# Altium project TSAL_Control.PrjPcb (part 2 of 4)

## Sheet [2] Implausibilities.SchDoc
size A4
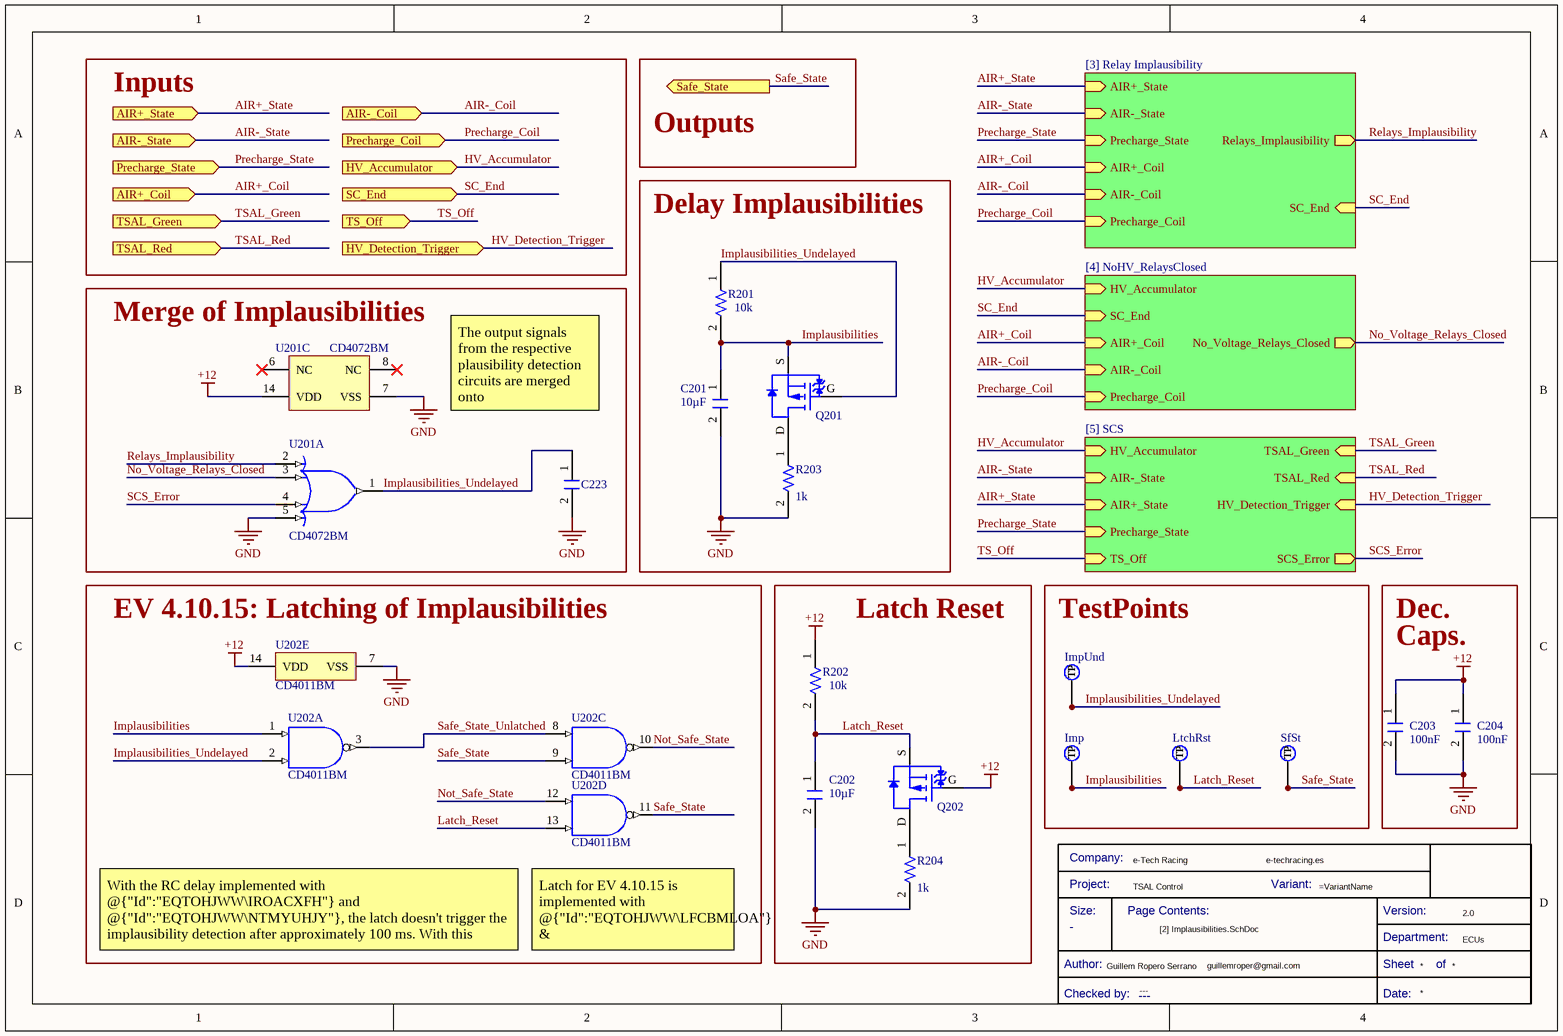
[diagram p2: [2] Implausibilities.SchDoc]

### Parts
(Parts that share a designator on the sheet are numbered #1, #2 ... from top to bottom, then left to right.)
*#3  Checked by:: ---  (hidden comment: Title Block_template)  (graphical)
C201  value 10µF  [C0805FNPC-R]  (hidden comment: C10u-16V-0805FNPC-X5R)
C202  value 10µF  [C0805FNPC-R]  (hidden comment: C10u-16V-0805FNPC-X5R)
C203  value 100nF  [C0805FNPC-R]  (hidden comment: C100n-50V-0805FNPC-X7R)
C204  value 100nF  [C0805FNPC-R]  (hidden comment: C100n-50V-0805FNPC-X7R)
C223  C15p-50V-0805FNPC-NP0  [C0805FNPC-R]  (value not drawn)
Imp  TestPoint  [TestPoint]  (value not drawn)  (no BOM)
ImpUnd  TestPoint  [TestPoint]  (value not drawn)  (no BOM)
LtchRst  TestPoint  [TestPoint]  (value not drawn)  (no BOM)
Q201  TRT-PCH-2/30-BSS  [TRT-PCH-2/30-BSS]  (value not drawn)
Q202  TRT-PCH-2/30-BSS  [TRT-PCH-2/30-BSS]  (value not drawn)
R201  value 10k  [R0805FTK]  (hidden comment: R10k-0805FTK)
R202  value 10k  [R0805FTK]  (hidden comment: R10k-0805FTK)
R203  value 1k  [0805]  (hidden comment: R1K-0805-0.5W)
R204  value 1k  [0805]  (hidden comment: R1K-0805-0.5W)
SfSt  TestPoint  [TestPoint]  (value not drawn)  (no BOM)
U201  CD4072BM  [D0014A_N]  (parts A,C of 3)
U202  CD4011BM  [D0014A_N]  (parts A,C,D,E of 5)

### Blocks framed on the sheet
Delay Implausibilities: C201 Q201 R201 R203
Merge of Implausibilities: C223 U201
EV 4.10.15: Latching of Implausibilities: U202
Latch Reset: C202 Q202 R202 R204
TestPoints: Imp ImpUnd LtchRst SfSt

### Sub-sheets
EV 4.10.14 = [4] NoHV_RelaysClosed: HV_Accumulator (in), SC_End (in), AIR+_Coil (in), AIR-_Coil (in), Precharge_Coil (in), No_Voltage_Relays_Closed (out)
Relay Implausibility = [3] Relay Implausibility: AIR+_State (in), Precharge_State (in), AIR+_Coil (in), AIR-_Coil (in), Precharge_Coil (in), Relays_Implausibility (out), SC_End (in), AIR-_State (in)
SCS = [5] SCS: HV_Accumulator (in), AIR-_State (in), Precharge_State (in), SCS_Error (out), AIR+_State (in), TSAL_Green (in), TSAL_Red (in), TS_Off (in), HV_Detection_Trigger (in)

### Ports
AIR+_Coil (in, see [1] TSAL_Green[1C], [1] TSAL_Green[2A], [3] Relay Implausibility[1A], [4] NoHV_RelaysClosed[1A]), AIR+_State (in, see [1] TSAL_Green[1C], [1] TSAL_Green[2A], [3] Relay Implausibility[1A], [5] SCS[1A]), AIR-_Coil (in, see [1] TSAL_Green[1C], [1] TSAL_Green[2A], [3] Relay Implausibility[1A], [4] NoHV_RelaysClosed[1A]), AIR-_State (in, see [1] TSAL_Green[1C], [1] TSAL_Green[2A], [3] Relay Implausibility[1A], [5] SCS[1A]), HV_Accumulator (in, see [1] TSAL_Green[1C], [1] TSAL_Green[2B], [4] NoHV_RelaysClosed[1A], [5] SCS[1A]), HV_Detection_Trigger (in, see [1] TSAL_Green[1C], [1] TSAL_Green[2B], [5] SCS[1A], [7] TSAL_Red[2A]), Precharge_Coil (in, see [1] TSAL_Green[1C], [1] TSAL_Green[2B], [3] Relay Implausibility[1A], [4] NoHV_RelaysClosed[1A]), Precharge_State (in, see [1] TSAL_Green[1C], [1] TSAL_Green[2A], [3] Relay Implausibility[1A], [5] SCS[1A]), Safe_State (out, see [1] TSAL_Green[2C]), SC_End (in, see [1] TSAL_Green[1C], [1] TSAL_Green[2B], [3] Relay Implausibility[1B], [4] NoHV_RelaysClosed[1A]), TS_Off (in, see [1] TSAL_Green[1D], [1] TSAL_Green[4A], [5] SCS[1A], [6] Green_Driver[1A]), TSAL_Green (in, see [1] TSAL_Green[1D], [1] TSAL_Green[4A], [5] SCS[1A], [6] Green_Driver[2A]), TSAL_Red (in, see [1] TSAL_Green[1D], [1] TSAL_Green[3A], [5] SCS[1B], [7] TSAL_Red[2A], [8] Red_Driver[2A])

### Nets
+12: C203.1 C204.1 Q202.G R202.1 U201.14(VDD) U202.14(VDD)
GND: C201.2 C202.2 C203.2 C204.2 C223.2 R203.2 R204.2 U201.5(D) U201.7(VSS) U202.7(VSS)
AIR+_Coil: port AIR+_Coil, sheet Relay Implausibility/AIR+_Coil, sheet EV 4.10.14/AIR+_Coil
AIR+_State: port AIR+_State, sheet Relay Implausibility/AIR+_State, sheet SCS/AIR+_State
AIR-_Coil: port AIR-_Coil, sheet Relay Implausibility/AIR-_Coil, sheet EV 4.10.14/AIR-_Coil
AIR-_State: port AIR-_State, sheet Relay Implausibility/AIR-_State, sheet SCS/AIR-_State
HV_Accumulator: port HV_Accumulator, sheet SCS/HV_Accumulator, sheet EV 4.10.14/HV_Accumulator
HV_Detection_Trigger: port HV_Detection_Trigger, sheet SCS/HV_Detection_Trigger
Implausibilities: C201.1 Imp.1(TP) Q201.S R201.2 U202.1(A)
Implausibilities_Undelayed: C223.1 ImpUnd.1(TP) Q201.G R201.1 U201.1(J) U202.2(B)
Latch_Reset: C202.1 LtchRst.1(TP) Q202.S R202.2 U202.13(H)
No_Voltage_Relays_Closed: U201.3(B) ; sheet EV 4.10.14/No_Voltage_Relays_Closed
Not_Safe_State: U202.10(L) U202.12(G)
Precharge_Coil: port Precharge_Coil, sheet Relay Implausibility/Precharge_Coil, sheet EV 4.10.14/Precharge_Coil
Precharge_State: port Precharge_State, sheet Relay Implausibility/Precharge_State, sheet SCS/Precharge_State
Relays_Implausibility: U201.2(A) ; sheet Relay Implausibility/Relays_Implausibility
Safe_State: SfSt.1(TP) U202.9(F) U202.11(M) ; port Safe_State
Safe_State_Unlatched: U202.3(J) U202.8(E)
SC_End: port SC_End, sheet Relay Implausibility/SC_End, sheet EV 4.10.14/SC_End
SCS_Error: U201.4(C) ; sheet SCS/SCS_Error
TS_Off: port TS_Off, sheet SCS/TS_Off
TSAL_Green: port TSAL_Green, sheet SCS/TSAL_Green
TSAL_Red: port TSAL_Red, sheet SCS/TSAL_Red
NetQ201_D: Q201.D R203.1
NetQ202_D: Q202.D R204.1

Not connected (* = marked no-connect by the designer): U201 6(NC)* 8(NC)*

### Notes on the sheet
- Inputs
- Outputs
- The output signals from the respective plausibility detection circuits are merged onto @{"Id":"EQTOHJWW\DMHHQXNO"}.
- Dec.
- Caps.
- With the RC delay implemented with @{"Id":"EQTOHJWW\IROACXFH"} and @{"Id":"EQTOHJWW\NTMYUHJY"}, the latch doesn't trigger the implausibility detection after approximately 100 ms. With this system, possible faulty implausibility detections are avoided (e.g. AIRs activation delay).
- (near U202) Latch for EV 4.10.15 is implemented with @{"Id":"EQTOHJWW\LFCBMLOA"} & @{"Id":"EQTOHJWW\TXFEAGDM"}
- (in symbol CMP-00043-8) Company:; Project:; Variant:; Size:; Page Contents:; Version:; Department:; Author:; Sheet; of; Checked by:; Date:

### Library data of the parts
*#3 = CMP-00043-8: Standard Title Block; .SCHcheck: GP; Size: -; Design Item ID: Title Block_template; .PCBcheck: GP; .Creator: GP; Source: e-Tech_Racing.SchLib; Category: Title Block
C201 C202 = CMP-00055-8: Multilayer Ceramic Capacitor, Wcap-Csgp Series, 10 F, 20%, X5R, 16 V, 0805 [2012 Metric] Rohs Compliant: Yes; Manufacturer Part Number 1: 885012107014; Manufacturer 1: Wurth Electronics; .Creator: DR; Voltage Rating: 16V; Pricing 1: 50=0,21000, 250=0,20200, 500=0,19100, 1000=0,17400, 2500=0,14700 (GBP); ComponentLink3URL: https://katalog.we-online.de/pbs/datasheet/885012107014.pdf?src-supplier=Digi-Key; Category: Ceramic Capacitors; Thickness: 0.057inch; ComponentLink4URL: http://www.farnell.com/datasheets/1958454.pdf?src-supplier=Newark; Width: 0.049inch; Source: Passives.SchLib; Design Item ID: C10u-16V-0805FNPC-X5R; Packaging: Cut Tape; ComponentLink3Description: https://katalog.we-online.de/pbs/datasheet/885012107014.pdf?src-supplier=Digi-Key; ComponentLink2URL: http://www.farnell.com/datasheets/1958454.pdf?src-supplier=Element14; RoHS: Yes; ComponentLink1Description: http://www.farnell.com/datasheets/1958454.pdf?src-supplier=Farnell; ComponentLink2Description: http://www.farnell.com/datasheets/1958454.pdf?src-supplier=Element14; Min Operating Temperature: -55°C; Case Code (Metric): 2012; Case/Package: 0805; Mount: Surface Mount; Tolerance: 20%; Length: 0.079inch; ComponentLink4Description: http://www.farnell.com/datasheets/1958454.pdf?src-supplier=Newark; ComponentLink1URL: http://www.farnell.com/datasheets/1958454.pdf?src-supplier=Farnell; Dielectric: X5R; RoHS Compliant: Yes; Voltage Rating (DC): 16V; Max Operating Temperature: 85°C; Stock 1: 81550; REACH SVHC: Unknown
C203 C204 = CMP-00063-3: Cap, 0.1ΜF, 50V, 10%, X7R, 0805; Manufacturer Part Number 1: 885012207098; Manufacturer 1: Wurth Electronics; .Creator: DR; ComponentLink2Description: http://www.farnell.com/datasheets/1958498.pdf?src-supplier=Element14; ComponentLink1Description: http://www.farnell.com/datasheets/1958498.pdf?src-supplier=Farnell; Thickness: 0.035inch; ComponentLink1URL: http://www.farnell.com/datasheets/1958498.pdf?src-supplier=Farnell; Min Operating Temperature: -55°C; Packaging: Cut Tape; ComponentLink2URL: http://www.farnell.com/datasheets/1958498.pdf?src-supplier=Element14; Mount: Surface Mount; Voltage Rating (DC): 50V; Tolerance: 10%; Category: Ceramic Capacitors; RoHS: Yes; Width: 0.049inch; Pricing 1: 100=0,10200, 500=0,07100, 2000=0,06100 (GBP); RoHS Compliant: Yes; ComponentLink4Description: http://www.farnell.com/datasheets/1958498.pdf?src-supplier=Newark; Dielectric: X7R; Stock 1: 8000; Length: 0.079inch; ComponentLink3URL: https://katalog.we-online.de/pbs/datasheet/885012207098.pdf?src-supplier=Digi-Key; ComponentLink3Description: https://katalog.we-online.de/pbs/datasheet/885012207098.pdf?src-supplier=Digi-Key; Design Item ID: C100n-50V-0805FNPC-X7R; ComponentLink4URL: http://www.farnell.com/datasheets/1958498.pdf?src-supplier=Newark; REACH SVHC: Unknown; Case Code (Metric): 2012; Voltage Rating: 50V; Max Operating Temperature: 125°C; Source: Passives.SchLib; Case/Package: 0805
C223 = CMP-00056-3: Cap, 15PF, 50V, 5%, C0G/NP0, 0805; Manufacturer Part Number 1: 885012007052; Manufacturer 1: Wurth Electronics; .Creator: DR; Thickness: 0.028inch; RoHS Compliant: Yes; ComponentLink2URL: http://katalog.we-online.de/pbs/datasheet/885012007052.pdf?src-supplier=Digi-Key; Design Item ID: C15p-50V-0805FNPC-NP0; Case Code (Metric): 2012; Max Operating Temperature: 125°C; Mount: Surface Mount; Category: Ceramic Capacitors; Min Operating Temperature: -55°C; Case/Package: 0805; ComponentLink3Description: https://katalog.we-online.de/pbs/datasheet/885012007052.pdf?src-supplier=Digi-Key; ComponentLink1Description: http://www.farnell.com/datasheets/2031702.pdf?src-supplier=Farnell; ComponentLink1URL: http://www.farnell.com/datasheets/2031702.pdf?src-supplier=Farnell; RoHS: Yes; Voltage Rating: 50V; Length: 0.079inch; Source: Passives.SchLib; Value: 15pF; Pricing 1: 1=0,10800, 10=0,05200, 25=0,05100, 50=0,04900, 100=0,04800, 250=0,04600, 500=0,04300 (USD); Tolerance: 5%; ComponentLink3URL: https://katalog.we-online.de/pbs/datasheet/885012007052.pdf?src-supplier=Digi-Key; Stock 1: 815; Packaging: Cut Tape; Width: 0.049inch; ComponentLink2Description: http://katalog.we-online.de/pbs/datasheet/885012007052.pdf?src-supplier=Digi-Key
Imp ImpUnd LtchRst SfSt = CMP-00042-2: Test Point 1x1 mm; .SCHcheck: GP; Category: TestPoint; Source: e-Tech_Racing.SchLib; .Creator: GP; .PCBcheck: GP; Design Item ID: TestPoint
Q201 Q202 = CMP-00144-2: Infineon’s highly innovative OptiMOS™ families include p-channel power MOSFETs, SOT-23-3, RoHS; Manufacturer Part Number: BSS308PEH6327; .Creator: DO; Drain to Source Voltage (Vdss): 30V; Rise Time: 7.7ns; Turn-On Delay Time: 5.6ns; Fall Time: 2.8ns; Input Capacitance: 500pF; Turn-Off Delay Time: 15.3ns; Rds On Max: 80mR; Threshold Voltage: -1.5V; Gate to Source Voltage (Vgs): 20V; Max Power Dissipation: 500mW; Continuous Drain Current (ID): 2A; Stock 1: 4000; ComponentLink1Description: datasheet; Series: OptiMOS™; Source: Semiconductor.SchLib; Number of Pins: 3; ComponentLink2Description: https://datasheet.ciiva.com/11171/infineon-bss308pe-ds-v02-03-en-11171385.pdf?src-supplier=Avnet; REACH SVHC: No SVHC; Mount: Surface Mount; Min Operating Temperature: -55°C; Package Quantity: 1; Design Item ID: TRT-PCH-2/30-BSS; Max Operating Temperature: 150°C; Packaging: Tape and Reel; RoHS: Yes; Category: MOSFETs; Pricing 1: 50=0,50300, 100=0,26400, 250=0,25900, 500=0,25200, 1000=0,24700 (USD); Case/Package: TO-236-3; ComponentLink1URL: https://datasheet.ciiva.com/6379/infineon-bss308pe-ds-v02-03-en-6379920.pdf?src-supplier=Digi-Key; ComponentLink2URL: https://datasheet.ciiva.com/11171/infineon-bss308pe-ds-v02-03-en-11171385.pdf?src-supplier=Avnet; Manufacturer: Infineon
R201 R202 = CMP-00085-4: BOURNS         CR0805-JW-103ELF            Surface Mount Chip Resistor, Thick Film, CR Series, 10 kohm, 125 mW,  5%, 150 V; .Creator: DR; Power Rating: 125mW; Voltage Rating (DC): 100V; Voltage Rating: 150V; Temperature Coefficient: 200ppm/°C; ComponentLink6URL: https://datasheet.ciiva.com/16783/70154685-16783482.pdf?src-supplier=Allied+Electronics; Manufacturer 1: Bourns; Package Quantity: 1; ComponentLink10URL: https://datasheet.ciiva.com/7985/1856384-7985869.pdf?src-supplier=Element14; Technology: THICK FILM; Source: Passives.SchLib; RoHS Compliant: Yes; ComponentLink10Description: https://datasheet.ciiva.com/7985/1856384-7985869.pdf?src-supplier=Element14; ComponentLink1URL: https://datasheet.ciiva.com/11821/0900766b80fcdb72-11821135.pdf?src-supplier=RSComponents; ComponentLink7Description: https://datasheet.ciiva.com/5548/chpreztr-5548491.pdf?src-supplier=Mouser; Radiation Hardening: No; Design Item ID: R10k-0805FTK; ComponentLink4Description: https://datasheet.ciiva.com/7986/691949-7986187.pdf?src-supplier=Element14; Pins: 2; ComponentLink9URL: https://datasheet.ciiva.com/6559/chpreztr-6559901.pdf?src-supplier=Digi-Key; Resistor Type: Thick Film; ComponentLink4URL: https://datasheet.ciiva.com/7986/691949-7986187.pdf?src-supplier=Element14; Contact Plating: Tin; Case Code (Metric): 2012; Military Standard: Not; Depth: 1.25mm; Case/Package: 0805; Packaging: Tape and Reel; ComponentLink9Description: https://datasheet.ciiva.com/6559/chpreztr-6559901.pdf?src-supplier=Digi-Key; Construction: Rectangular; Pricing 1: 1=0,05790, 10=0,01540, 25=0,01340, 100=0,00340 (USD); ComponentLink7URL: https://datasheet.ciiva.com/5548/chpreztr-5548491.pdf?src-supplier=Mouser; Category: Chip SMD Resistors; Length: 2mm; Max Operating Temperature: 155°C; Resistance Tolerance: 5%; Manufacturer Part Number 1: CR0805-JW-103ELF; Height: 0.5mm; ComponentLink2URL: https://datasheet.ciiva.com/9122/chpreztr-9122374.pdf?src-supplier=Avnet; Thickness: 508um; Max Power Dissipation: 125mW; ComponentLink8Description: https://datasheet.ciiva.com/6559/chpreztr-6559900.pdf?src-supplier=Digi-Key; REACH SVHC: No SVHC; ComponentLink8URL: https://datasheet.ciiva.com/6559/chpreztr-6559900.pdf?src-supplier=Digi-Key; ComponentLink5URL: https://datasheet.ciiva.com/30065/159chpreztr-30065976.pdf?src-supplier=Onlinecomponents.com; Width: 1.25mm; ComponentLink11URL: https://datasheet.ciiva.com/48692/001055517-da-01-en-smd-wid-cr0805-jw-103elf-10k-ohm-1-8w-48692118.pdf?src-supplier=Conrad; ComponentLink3Description: https://datasheet.ciiva.com/22693/1902866-22693254.pdf?src-supplier=Element14; ComponentLink11Description: https://datasheet.ciiva.com/48692/001055517-da-01-en-smd-wid-cr0805-jw-103elf-10k-ohm-1-8w-48692118.pdf?src-supplier=Conrad; ComponentLink1Description: https://datasheet.ciiva.com/11821/0900766b80fcdb72-11821135.pdf?src-supplier=RSComponents; ComponentLink2Description: https://datasheet.ciiva.com/9122/chpreztr-9122374.pdf?src-supplier=Avnet; Stock 1: 57566; Min Operating Temperature: -55°C; Series: CR0805; Number of Terminations: 2; Termination: SMD/SMT; Tolerance: 5%; Mount: Surface Mount; ComponentLink6Description: https://datasheet.ciiva.com/16783/70154685-16783482.pdf?src-supplier=Allied+Electronics; ComponentLink5Description: https://datasheet.ciiva.com/30065/159chpreztr-30065976.pdf?src-supplier=Onlinecomponents.com; RoHS: Yes; Features: Moisture Resistant; ComponentLink3URL: https://datasheet.ciiva.com/22693/1902866-22693254.pdf?src-supplier=Element14
R203 R204 = CMP-009-00043-2: Fixed Resistor, Metal Glaze/thick Film, 0.5W, 1000ohm, 150V, 1% +/-Tol, 100ppm/Cel, Surface Mount, 0805; Power: 500mW; Pins: 2; RoHS Compliant: Yes; Tolerance: 1%; Case/Package: 0805; Min Operating Temperature: -55°C; Mounting Technology: Surface Mount; Max Operating Temperature: 155°C
U201 = CMP-00217-1: OR Gate, 4000/14000/40000 Series, 2-Func, 4-Input, CMOS, PDSO14; Package Equivalence Code: SOP14,.25; Package Body Material: Plastic; Power Supplies: 5/15V; Schmitt Trigger: No; Propagation Delay (tpd): 250ns; Nominal Supply Voltage: 5V; Min Supply Voltage: 3V; Channels: 2; Output Characteristics: OPEN-COLLECTOR; Max Supply Voltage: 18V; Load Capacitance (CL): 50pF; Logic Type: OR GATE; Qualification Status: Not Qualified; Number of Inputs: 4; Length: 8.65mm; Technology: CMOS; Surface Mount: Yes; Packaging: Rail/Tube; JESD-609 Code: e4; Terminal Pitch: 1.27mm; Package Shape: Rectangular; Package Style: SMALL OUTLINEMeter; Max Operating Temperature: 125°C; Terminal Position: DUAL; Reach SVHC Compliant: Yes; Terminal Form: Gull Wing; JESD-30 Code: R-PDSO-G14; Width: 3.9mm; Moisture Sensitivity Level: 1; Peak Reflow Temperature (Cel): 260°C; Temperature Grade: MILITARY; Pins: 14; Case/Package: SOP; Terminal Finish: Nickel; Min Operating Temperature: -55°C; Height - Seated (Max): 1.75mm; Prop. Delay@Nom-Sup: 250ns; RoHS Compliant: Yes
U202 = CMP-00211-1: NAND Gate, 4000/14000/40000 Series, 4-Func, 2-Input, CMOS, PDSO14; Package Equivalence Code: SOP14,.25; Package Body Material: Plastic; Load Capacitance (CL): 50pF; Max Supply Voltage: 18V; Min Supply Voltage: 3V; Nominal Supply Voltage: 5V; Propagation Delay (tpd): 250ns; Number of Inputs: 2; Channels: 4; Qualification Status: Not Qualified; Load/Preset Input: Yes; Schmitt Trigger: No; Power Supplies: 5/15V; Height - Seated (Max): 1.75mm; Technology: CMOS; Surface Mount: Yes; Case/Package: SOP; Pins: 14; Terminal Finish: Nickel; RoHS Compliant: Yes; Terminal Pitch: 1.27mm; Length: 8.65mm; Reach SVHC Compliant: Yes; Temperature Grade: MILITARY; Moisture Sensitivity Level: 1; Peak Reflow Temperature (Cel): 260°C; JESD-30 Code: R-PDSO-G14; Package Style: SMALL OUTLINEMeter; Logic Type: NAND GATE; Package Shape: Rectangular; Terminal Form: Gull Wing; Prop. Delay@Nom-Sup: 250ns; JESD-609 Code: e4; Min Operating Temperature: -55°C; Max Operating Temperature: 125°C; Width: 3.9mm; Terminal Position: DUAL; Packaging: Tape and Reel

## Sheet [3] Relay Implausibility.SchDoc
size A4
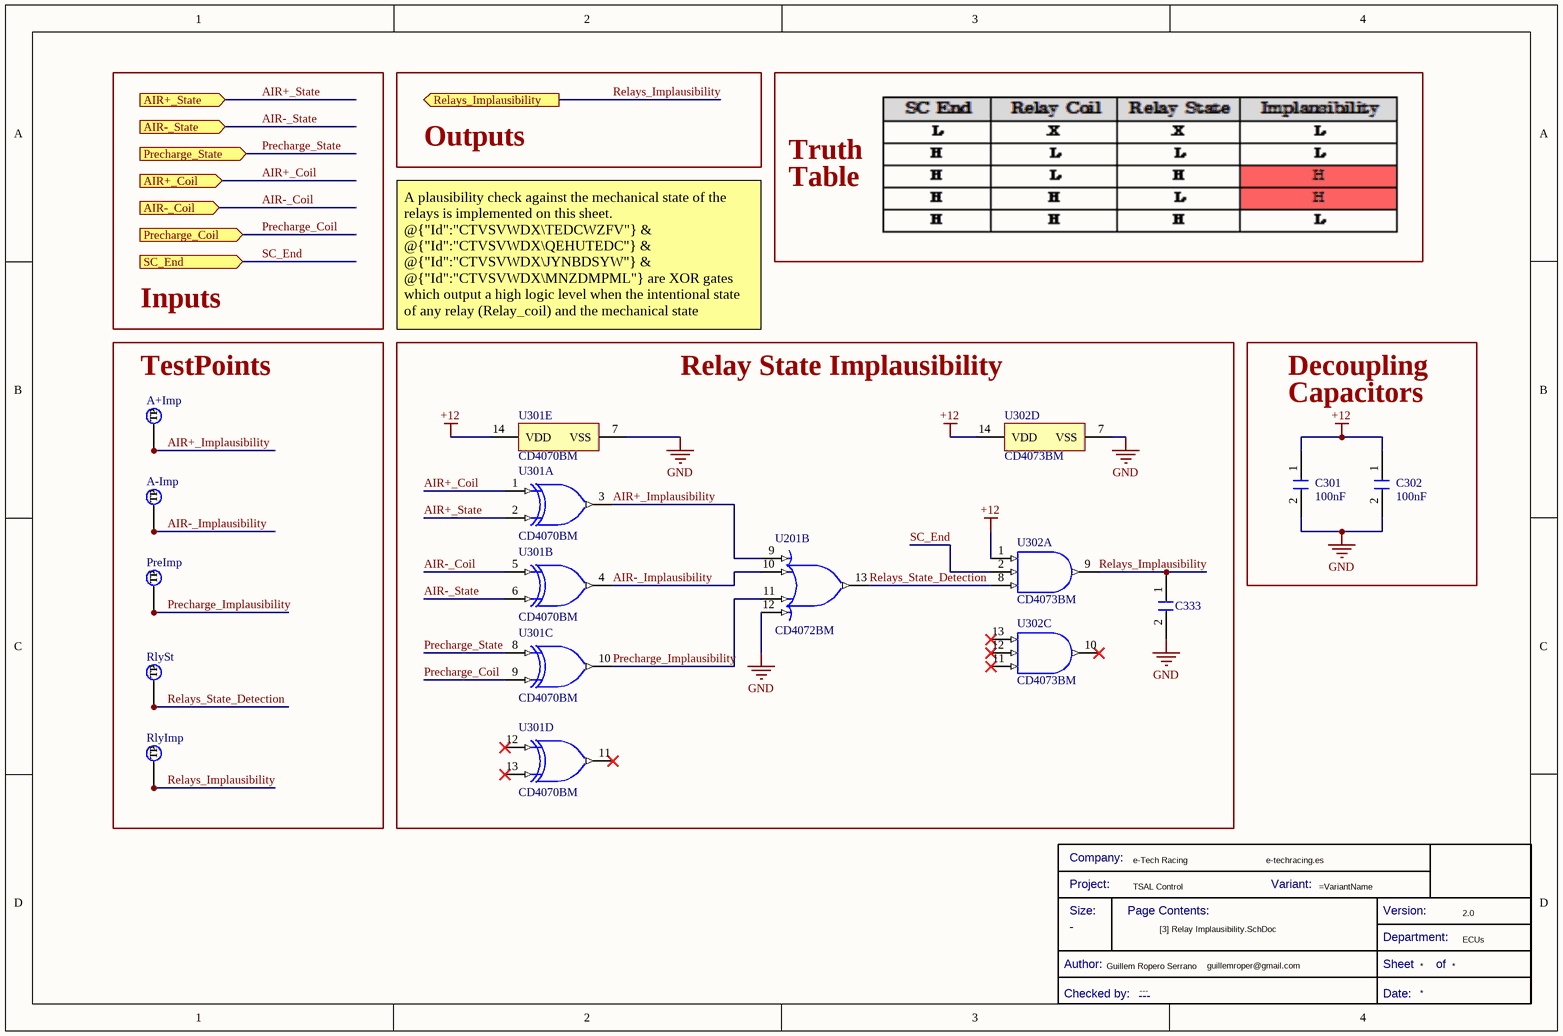
[diagram p3: [3] Relay Implausibility.SchDoc]

### Parts
(Parts that share a designator on the sheet are numbered #1, #2 ... from top to bottom, then left to right.)
*#4  Checked by:: ---  (hidden comment: Title Block_template)  (graphical)
A+Imp  TestPoint  [TestPoint]  (value not drawn)  (no BOM)
A-Imp  TestPoint  [TestPoint]  (value not drawn)  (no BOM)
C301  value 100nF  [C0805FNPC-R]  (hidden comment: C100n-50V-0805FNPC-X7R)
C302  value 100nF  [C0805FNPC-R]  (hidden comment: C100n-50V-0805FNPC-X7R)
C333  C15p-50V-0805FNPC-NP0  [C0805FNPC-R]  (value not drawn)
PreImp  TestPoint  [TestPoint]  (value not drawn)  (no BOM)
RlyImp  TestPoint  [TestPoint]  (value not drawn)  (no BOM)
RlySt  TestPoint  [TestPoint]  (value not drawn)  (no BOM)
U201  CD4072BM  [D0014A_N]  (part B of 3)
U301  CD4070BM  [D0014A_N]  (parts A,B,C,D,E of 5)
U302  CD4073BM  [D0014A_N]  (parts A,C,D of 4)

### Blocks framed on the sheet
TestPoints: A+Imp A-Imp PreImp RlyImp RlySt
Relay State Implausibility: C333 U201 U301 U302

### Ports
AIR+_Coil (in, see [2] Implausibilities[3A], [1] TSAL_Green[2A], [2] Implausibilities[1A], [4] NoHV_RelaysClosed[1A]), AIR+_State (in, see [2] Implausibilities[3A], [1] TSAL_Green[2A], [2] Implausibilities[1A], [5] SCS[1A]), AIR-_Coil (in, see [2] Implausibilities[3A], [1] TSAL_Green[2A], [2] Implausibilities[1A], [4] NoHV_RelaysClosed[1A]), AIR-_State (in, see [2] Implausibilities[3A], [1] TSAL_Green[2A], [2] Implausibilities[1A], [5] SCS[1A]), Precharge_Coil (in, see [2] Implausibilities[3A], [1] TSAL_Green[2B], [2] Implausibilities[1A], [4] NoHV_RelaysClosed[1A]), Precharge_State (in, see [2] Implausibilities[3A], [1] TSAL_Green[2A], [2] Implausibilities[1A], [5] SCS[1A]), Relays_Implausibility (out, see [2] Implausibilities[4A]), SC_End (in, see [2] Implausibilities[4A], [1] TSAL_Green[2B], [2] Implausibilities[1A], [4] NoHV_RelaysClosed[1A])

### Nets
+12: C301.1 C302.1 U301.14(VDD) U302.1(A) U302.14(VDD)
GND: C301.2 C302.2 C333.2 U201.12(H) U301.7(VSS) U302.7(VSS)
AIR+_Coil: U301.1(A) ; port AIR+_Coil
AIR+_Implausibility: A+Imp.1(TP) U201.9(E) U301.3(J)
AIR+_State: U301.2(B) ; port AIR+_State
AIR-_Coil: U301.5(C) ; port AIR-_Coil
AIR-_Implausibility: A-Imp.1(TP) U201.10(F) U301.4(K)
AIR-_State: U301.6(D) ; port AIR-_State
Precharge_Coil: U301.9(F) ; port Precharge_Coil
Precharge_Implausibility: PreImp.1(TP) U201.11(G) U301.10(L)
Precharge_State: U301.8(E) ; port Precharge_State
Relays_Implausibility: C333.1 RlyImp.1(TP) U302.9(J) ; port Relays_Implausibility
Relays_State_Detection: RlySt.1(TP) U201.13(K) U302.8(C)
SC_End: U302.2(B) ; port SC_End

Not connected (* = marked no-connect by the designer): U301 11(M)* 12(G)* 13(H)*; U302 10(L)* 11(I)* 12(H)* 13(G)*

### Notes on the sheet
- Outputs
- Truth
- Table
- Inputs
- A plausibility check against the mechanical state of the relays is implemented on this sheet. @{"Id":"CTVSVWDX\TEDCWZFV"} & @{"Id":"CTVSVWDX\QEHUTEDC"} & @{"Id":"CTVSVWDX\JYNBDSYW"} & @{"Id":"CTVSVWDX\MNZDMPML"} are XOR gates which output a high logic level when the intentional state of any relay (Relay_coil) and the mechanical state (Relay_state) differ.
  As the Relay's Coil inside the TSAC are supplied directly from the Shutdown Chain, the @{"Id":"CTVSVWDX\UYTFIWRP"} conditions the implausibility detection with the SC to be closed.
- Decoupling
- Capacitors
- (in symbol CMP-00043-8) Company:; Project:; Variant:; Size:; Page Contents:; Version:; Department:; Author:; Sheet; of; Checked by:; Date:

### Library data of the parts
*#4 = CMP-00043-8: Standard Title Block; .SCHcheck: GP; Size: -; Design Item ID: Title Block_template; .PCBcheck: GP; .Creator: GP; Source: e-Tech_Racing.SchLib; Category: Title Block
A+Imp A-Imp PreImp RlyImp RlySt = CMP-00042-2: Test Point 1x1 mm; .SCHcheck: GP; Category: TestPoint; Source: e-Tech_Racing.SchLib; .Creator: GP; .PCBcheck: GP; Design Item ID: TestPoint
C301 C302 = CMP-00063-3: as C203 on sheet [2] Implausibilities; ComponentLink2Description: http://www.farnell.com/datasheets/1958498.pdf?src-supplier=Element14; ComponentLink1Description: http://www.farnell.com/datasheets/1958498.pdf?src-supplier=Farnell; Thickness: 0.035inch; ComponentLink1URL: http://www.farnell.com/datasheets/1958498.pdf?src-supplier=Farnell; Min Operating Temperature: -55°C; Packaging: Cut Tape; ComponentLink2URL: http://www.farnell.com/datasheets/1958498.pdf?src-supplier=Element14; Mount: Surface Mount; Voltage Rating (DC): 50V; Tolerance: 10%; Category: Ceramic Capacitors; RoHS: Yes; Width: 0.049inch; Pricing 1: 100=0,10200, 500=0,07100, 2000=0,06100 (GBP); RoHS Compliant: Yes; ComponentLink4Description: http://www.farnell.com/datasheets/1958498.pdf?src-supplier=Newark; Dielectric: X7R; Stock 1: 8000; Length: 0.079inch; ComponentLink3URL: https://katalog.we-online.de/pbs/datasheet/885012207098.pdf?src-supplier=Digi-Key; ComponentLink3Description: https://katalog.we-online.de/pbs/datasheet/885012207098.pdf?src-supplier=Digi-Key; Design Item ID: C100n-50V-0805FNPC-X7R; ComponentLink4URL: http://www.farnell.com/datasheets/1958498.pdf?src-supplier=Newark; REACH SVHC: Unknown; Case Code (Metric): 2012; Voltage Rating: 50V; Max Operating Temperature: 125°C; Source: Passives.SchLib; Case/Package: 0805
C333 = CMP-00056-3: as C223 on sheet [2] Implausibilities; Thickness: 0.028inch; RoHS Compliant: Yes; ComponentLink2URL: http://katalog.we-online.de/pbs/datasheet/885012007052.pdf?src-supplier=Digi-Key; Design Item ID: C15p-50V-0805FNPC-NP0; Case Code (Metric): 2012; Max Operating Temperature: 125°C; Mount: Surface Mount; Category: Ceramic Capacitors; Min Operating Temperature: -55°C; Case/Package: 0805; ComponentLink3Description: https://katalog.we-online.de/pbs/datasheet/885012007052.pdf?src-supplier=Digi-Key; ComponentLink1Description: http://www.farnell.com/datasheets/2031702.pdf?src-supplier=Farnell; ComponentLink1URL: http://www.farnell.com/datasheets/2031702.pdf?src-supplier=Farnell; RoHS: Yes; Voltage Rating: 50V; Length: 0.079inch; Source: Passives.SchLib; Value: 15pF; Pricing 1: 1=0,10800, 10=0,05200, 25=0,05100, 50=0,04900, 100=0,04800, 250=0,04600, 500=0,04300 (USD); Tolerance: 5%; ComponentLink3URL: https://katalog.we-online.de/pbs/datasheet/885012007052.pdf?src-supplier=Digi-Key; Stock 1: 815; Packaging: Cut Tape; Width: 0.049inch; ComponentLink2Description: http://katalog.we-online.de/pbs/datasheet/885012007052.pdf?src-supplier=Digi-Key
U201 = CMP-00217-1: as U201 on sheet [2] Implausibilities; Length: 8.65mm; Technology: CMOS; Surface Mount: Yes; Packaging: Rail/Tube; JESD-609 Code: e4; Terminal Pitch: 1.27mm; Package Shape: Rectangular; Package Style: SMALL OUTLINEMeter; Max Operating Temperature: 125°C; Terminal Position: DUAL; Reach SVHC Compliant: Yes; Terminal Form: Gull Wing; JESD-30 Code: R-PDSO-G14; Width: 3.9mm; Moisture Sensitivity Level: 1; Peak Reflow Temperature (Cel): 260°C; Temperature Grade: MILITARY; Pins: 14; Case/Package: SOP; Terminal Finish: Nickel; Min Operating Temperature: -55°C; Height - Seated (Max): 1.75mm; Prop. Delay@Nom-Sup: 250ns; RoHS Compliant: Yes
U301 = CMP-00216-1: XOR Gate, 4000/14000/40000 Series, 4-Func, 2-Input, CMOS, PDSO14; Package Equivalence Code: SOP14,.25; Number of Inputs: 2; Nominal Supply Voltage: 5V; Qualification Status: Not Qualified; Max Supply Voltage: 18V; Channels: 4; Min Supply Voltage: 3V; Prop. Delay@Nom-Sup: 280ns; Package Body Material: Plastic; Schmitt Trigger: No; Load Capacitance (CL): 50pF; Power Supplies: 5/15V; RoHS Compliant: Yes; Temperature Grade: MILITARY; Max Operating Temperature: 125°C; Packaging: Tape and Reel; Peak Reflow Temperature (Cel): 260°C; Height - Seated (Max): 1.75mm; Surface Mount: Yes; Technology: CMOS; Terminal Finish: Nickel; Terminal Pitch: 1.27mm; JESD-609 Code: e4; JESD-30 Code: R-PDSO-G14; Case/Package: SOP; Moisture Sensitivity Level: 1; Terminal Form: Gull Wing; Min Operating Temperature: -55°C; Width: 3.9mm; Length: 8.65mm; Terminal Position: DUAL; Pins: 14; Reach SVHC Compliant: Yes; Package Style: SMALL OUTLINEMeter; Logic Type: XOR GATE; Propagation Delay (tpd): 280ns; Package Shape: Rectangular
U302 = CMP-00213-1: AND Gate, 4000/14000/40000 Series, 3-Func, 3-Input, CMOS, PDSO14; Propagation Delay (tpd): 250ns; Nominal Supply Voltage: 5V; Power Supplies: 5/15V; Qualification Status: Not Qualified; Package Equivalence Code: SOP14,.25; Channels: 3; Min Supply Voltage: 3V; Package Body Material: Plastic; Max Supply Voltage: 18V; Load Capacitance (CL): 50pF; Load/Preset Input: Yes; Schmitt Trigger: No; Terminal Pitch: 1.27mm; Terminal Form: Gull Wing; Length: 8.65mm; Logic Type: AND GATE; Prop. Delay@Nom-Sup: 250ns; Package Style: SMALL OUTLINEMeter; JESD-609 Code: e4; Package Shape: Rectangular; Moisture Sensitivity Level: 1; Max Operating Temperature: 125°C; Min Operating Temperature: -55°C; Case/Package: SOP; Terminal Finish: Nickel; Width: 3.9mm; Surface Mount: Yes; Reach SVHC Compliant: Yes; Technology: CMOS; Terminal Position: DUAL; Height - Seated (Max): 1.75mm; Temperature Grade: MILITARY; Number of Inputs: 3; Packaging: Rail/Tube; Pins: 14; Peak Reflow Temperature (Cel): 260°C; JESD-30 Code: R-PDSO-G14; RoHS Compliant: Yes

## Sheet [5] SCS.SchDoc
size A4
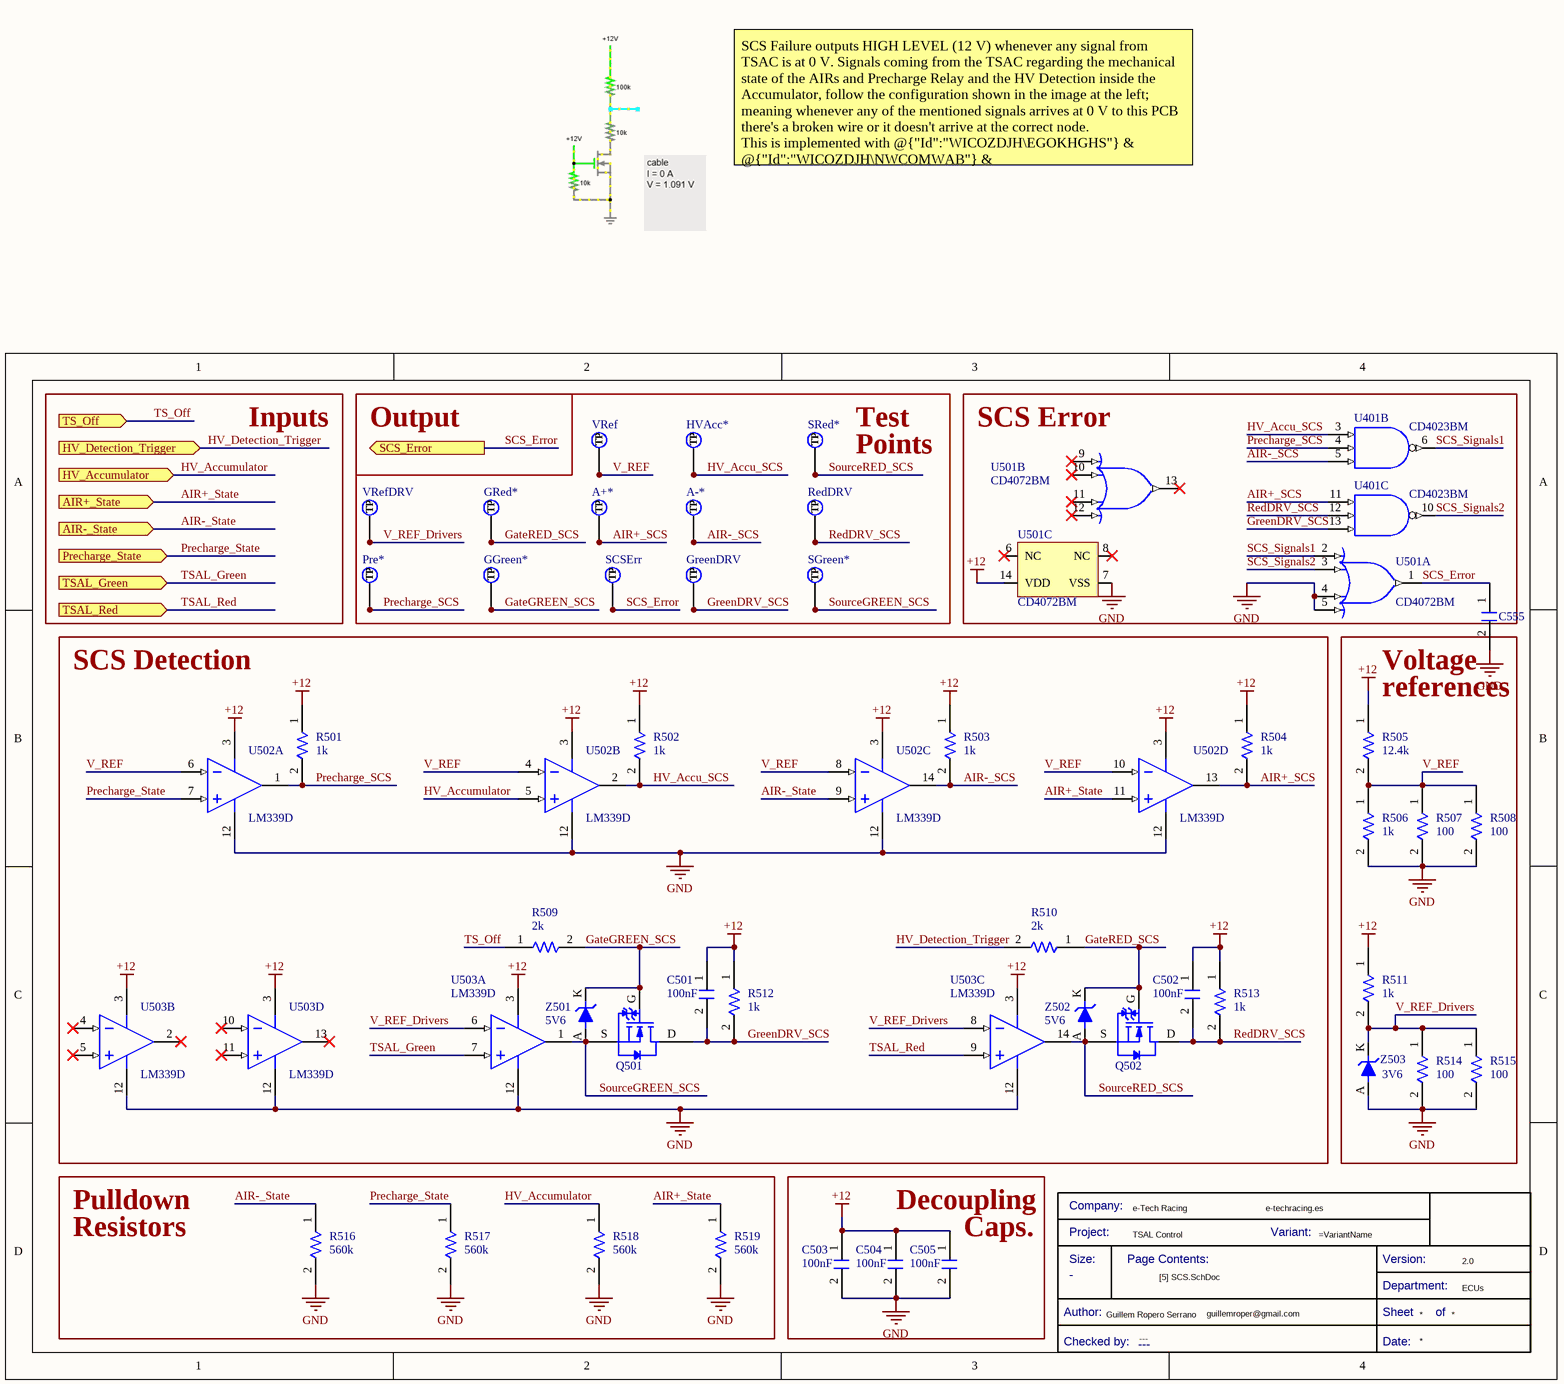
[diagram p4: [5] SCS.SchDoc]

### Parts
(Parts that share a designator on the sheet are numbered #1, #2 ... from top to bottom, then left to right.)
*#5  Checked by:: ---  (hidden comment: Title Block_template)  (graphical)
A+*  TestPoint  [TestPoint]  (value not drawn)  (no BOM)
A-*  TestPoint  [TestPoint]  (value not drawn)  (no BOM)
C501  value 100nF  [C0805FNPC-R]  (hidden comment: C100n-50V-0805FNPC-X7R)
C502  value 100nF  [C0805FNPC-R]  (hidden comment: C100n-50V-0805FNPC-X7R)
C503  value 100nF  [C0805FNPC-R]  (hidden comment: C100n-50V-0805FNPC-X7R)
C504  value 100nF  [C0805FNPC-R]  (hidden comment: C100n-50V-0805FNPC-X7R)
C505  value 100nF  [C0805FNPC-R]  (hidden comment: C100n-50V-0805FNPC-X7R)
C555  C15p-50V-0805FNPC-NP0  [C0805FNPC-R]  (value not drawn)
GGreen*  TestPoint  [TestPoint]  (value not drawn)  (no BOM)
GRed*  TestPoint  [TestPoint]  (value not drawn)  (no BOM)
GreenDRV  TestPoint  [TestPoint]  (value not drawn)  (no BOM)
HVAcc*  TestPoint  [TestPoint]  (value not drawn)  (no BOM)
Pre*  TestPoint  [TestPoint]  (value not drawn)  (no BOM)
Q501  TRT-NCH-8/40-SQ  [TRT-NCH-3/35-CPH]  (value not drawn)
Q502  TRT-NCH-8/40-SQ  [TRT-NCH-3/35-CPH]  (value not drawn)
R501  value 1k  [R0805FTK]  (hidden comment: R1k-0805FTK)
R502  value 1k  [R0805FTK]  (hidden comment: R1k-0805FTK)
R503  value 1k  [R0805FTK]  (hidden comment: R1k-0805FTK)
R504  value 1k  [R0805FTK]  (hidden comment: R1k-0805FTK)
R505  value 12.4k  [0805]  (hidden comment: R12K4-0805-0.125W)
R506  value 1k  [0805]  (hidden comment: R1K-0805-0.5W)
R507  value 100  [R0805FTK]  (hidden comment: R100-0805FTK)
R508  value 100  [R0805FTK]  (hidden comment: R100-0805FTK)
R509  value 2k  [0805]  (hidden comment: R2K_0.5W_0805)
R510  value 2k  [0805]  (hidden comment: R2K_0.5W_0805)
R511  value 1k  [0805]  (hidden comment: R1K-0805-0.5W)
R512  value 1k  [R0805FTK]  (hidden comment: R1k-0805FTK)
R513  value 1k  [R0805FTK]  (hidden comment: R1k-0805FTK)
R514  value 100  [R0805FTK]  (hidden comment: R100-0805FTK)
R515  value 100  [R0805FTK]  (hidden comment: R100-0805FTK)
R516  value 560k  [0805]  (hidden comment: R560K-0805)
R517  value 560k  [0805]  (hidden comment: R560K-0805)
R518  value 560k  [0805]  (hidden comment: R560K-0805)
R519  value 560k  [0805]  (hidden comment: R560K-0805)
RedDRV  TestPoint  [TestPoint]  (value not drawn)  (no BOM)
SCSErr  TestPoint  [TestPoint]  (value not drawn)  (no BOM)
SGreen*  TestPoint  [TestPoint]  (value not drawn)  (no BOM)
SRed*  TestPoint  [TestPoint]  (value not drawn)  (no BOM)
U401  CD4023BM  [D0014A_N]  (parts B,C of 4)
U501  CD4072BM  [D0014A_N]  (parts A,B,C of 3)
U502  LM339D  [D0014A_N]  (parts A,B,C,D of 4)
U503  LM339D  [D0014A_N]  (parts A,B,C,D of 4)
VRef  TestPoint  [TestPoint]  (value not drawn)  (no BOM)
VRefDRV  TestPoint  [TestPoint]  (value not drawn)  (no BOM)
Z501  Zener Voltage: 5V6  [DO-214AC]  (hidden comment: DZ-5.6V-DO-214AC)
Z502  Zener Voltage: 5V6  [DO-214AC]  (hidden comment: DZ-5.6V-DO-214AC)
Z503  Zener Voltage: 3V6  [DZ-DO-214AC]  (hidden comment: DZ-3V6-1.25W-DO-214AC)

### Blocks framed on the sheet
SCS Error: C555 U401 U501
SCS Detection: C501 C502 Q501 Q502 R501-R504 R509 R510 R512 R513 U502 U503 Z501 Z502

### Ports
AIR+_State (in, see [2] Implausibilities[3B], [1] TSAL_Green[2A], [2] Implausibilities[1A], [3] Relay Implausibility[1A]), AIR-_State (in, see [2] Implausibilities[3B], [1] TSAL_Green[2A], [2] Implausibilities[1A], [3] Relay Implausibility[1A]), HV_Accumulator (in, see [2] Implausibilities[3B], [1] TSAL_Green[2B], [2] Implausibilities[1A], [4] NoHV_RelaysClosed[1A]), HV_Detection_Trigger (in, see [2] Implausibilities[4B], [1] TSAL_Green[2B], [2] Implausibilities[1A], [7] TSAL_Red[2A]), Precharge_State (in, see [2] Implausibilities[3C], [1] TSAL_Green[2A], [2] Implausibilities[1A], [3] Relay Implausibility[1A]), SCS_Error (out, see [2] Implausibilities[4C]), TS_Off (in, see [2] Implausibilities[3C], [1] TSAL_Green[4A], [2] Implausibilities[1A], [6] Green_Driver[1A]), TSAL_Green (in, see [2] Implausibilities[4B], [1] TSAL_Green[4A], [2] Implausibilities[1A], [6] Green_Driver[2A]), TSAL_Red (in, see [2] Implausibilities[4B], [1] TSAL_Green[3A], [2] Implausibilities[1A], [7] TSAL_Red[2A], [8] Red_Driver[2A])

### Nets
+12: C501.1 C502.1 C503.1 C504.1 C505.1 R501.1 R502.1 R503.1 R504.1 R505.1 R511.1 R512.1 R513.1 U501.14(VDD) U502.3(VCC) U503.3(VCC)
GND: C503.2 C504.2 C505.2 C555.2 R506.2 R507.2 R508.2 R514.2 R515.2 R516.2 R517.2 R518.2 R519.2 U501.4(C) U501.5(D) U501.7(VSS) U502.12(GND) U503.12(GND) Z503.A
AIR+_SCS: A+*.1(TP) R504.2 U401.11(I) U502.13(OUT4)
AIR+_State: R519.1 U502.11(IN4+) ; port AIR+_State
AIR-_SCS: A-*.1(TP) R503.2 U401.5(F) U502.14(OUT3)
AIR-_State: R516.1 U502.9(IN3+) ; port AIR-_State
GateGREEN_SCS: GGreen*.1(TP) Q501.G R509.2 Z501.K
GateRED_SCS: GRed*.1(TP) Q502.G R510.1 Z502.K
GreenDRV_SCS: C501.2 GreenDRV.1(TP) Q501.D R512.2 U401.13(G)
HV_Accu_SCS: HVAcc*.1(TP) R502.2 U401.3(D) U502.2(OUT2)
HV_Accumulator: R518.1 U502.5(IN2+) ; port HV_Accumulator
HV_Detection_Trigger: R510.2 ; port HV_Detection_Trigger
Precharge_SCS: Pre*.1(TP) R501.2 U401.4(E) U502.1(OUT1)
Precharge_State: R517.1 U502.7(IN1+) ; port Precharge_State
RedDRV_SCS: C502.2 Q502.D R513.2 RedDRV.1(TP) U401.12(H)
SCS_Error: C555.1 SCSErr.1(TP) U501.1(J) ; port SCS_Error
SCS_Signals1: U401.6(K) U501.2(A)
SCS_Signals2: U401.10(L) U501.3(B)
SourceGREEN_SCS: Q501.S SGreen*.1(TP) U503.1(OUT1) Z501.A
SourceRED_SCS: Q502.S SRed*.1(TP) U503.14(OUT3) Z502.A
TS_Off: R509.1 ; port TS_Off
TSAL_Green: U503.7(IN1+) ; port TSAL_Green
TSAL_Red: U503.9(IN3+) ; port TSAL_Red
V_REF: R505.2 R506.1 R507.1 R508.1 U502.4(IN2-) U502.6(IN1-) U502.8(IN3-) U502.10(IN4-) VRef.1(TP)
V_REF_Drivers: R511.2 R514.1 R515.1 U503.6(IN1-) U503.8(IN3-) VRefDRV.1(TP) Z503.K

Not connected (* = marked no-connect by the designer): U501 6(NC)* 8(NC)* 9(E)* 10(F)* 11(G)* 12(H)* 13(K)*; U503 2(OUT2)* 4(IN2-)* 5(IN2+)* 10(IN4-)* 11(IN4+)* 13(OUT4)*

### Notes on the sheet
- SCS Failure outputs HIGH LEVEL (12 V) whenever any signal from TSAC is at 0 V. Signals coming from the TSAC regarding the mechanical state of the AIRs and Precharge Relay and the HV Detection inside the Accumulator, follow the configuration shown in the image at the left; meaning whenever any of the mentioned signals arrives at 0 V to this PCB there's a broken wire or it doesn't arrive at the correct node.
  This is implemented with @{"Id":"WICOZDJH\EGOKHGHS"} & @{"Id":"WICOZDJH\NWCOMWAB"} & @{"Id":"WICOZDJH\OSDIWEFW"} & @{"Id":"WICOZDJH\TEKHYVMJ"}.
- Inputs
- Output
- (near SRed*) Test
- (near SRed*) Points
- Voltage
- references
- Pulldown
- Resistors
- Decoupling
- (near C505) Caps.
- (in symbol CMP-00043-8) Company:; Project:; Variant:; Size:; Page Contents:; Version:; Department:; Author:; Sheet; of; Checked by:; Date:

### Library data of the parts
*#5 = CMP-00043-8: Standard Title Block; .SCHcheck: GP; Size: -; Design Item ID: Title Block_template; .PCBcheck: GP; .Creator: GP; Source: e-Tech_Racing.SchLib; Category: Title Block
A+* A-* GGreen* GRed* GreenDRV HVAcc* Pre* RedDRV SCSErr SGreen* SRed* VRef VRefDRV = CMP-00042-2: Test Point 1x1 mm; .SCHcheck: GP; Category: TestPoint; Source: e-Tech_Racing.SchLib; .Creator: GP; .PCBcheck: GP; Design Item ID: TestPoint
C501-C505 = CMP-00063-3: as C203 on sheet [2] Implausibilities; ComponentLink2Description: http://www.farnell.com/datasheets/1958498.pdf?src-supplier=Element14; ComponentLink1Description: http://www.farnell.com/datasheets/1958498.pdf?src-supplier=Farnell; Thickness: 0.035inch; ComponentLink1URL: http://www.farnell.com/datasheets/1958498.pdf?src-supplier=Farnell; Min Operating Temperature: -55°C; Packaging: Cut Tape; ComponentLink2URL: http://www.farnell.com/datasheets/1958498.pdf?src-supplier=Element14; Mount: Surface Mount; Voltage Rating (DC): 50V; Tolerance: 10%; Category: Ceramic Capacitors; RoHS: Yes; Width: 0.049inch; Pricing 1: 100=0,10200, 500=0,07100, 2000=0,06100 (GBP); RoHS Compliant: Yes; ComponentLink4Description: http://www.farnell.com/datasheets/1958498.pdf?src-supplier=Newark; Dielectric: X7R; Stock 1: 8000; Length: 0.079inch; ComponentLink3URL: https://katalog.we-online.de/pbs/datasheet/885012207098.pdf?src-supplier=Digi-Key; ComponentLink3Description: https://katalog.we-online.de/pbs/datasheet/885012207098.pdf?src-supplier=Digi-Key; Design Item ID: C100n-50V-0805FNPC-X7R; ComponentLink4URL: http://www.farnell.com/datasheets/1958498.pdf?src-supplier=Newark; REACH SVHC: Unknown; Case Code (Metric): 2012; Voltage Rating: 50V; Max Operating Temperature: 125°C; Source: Passives.SchLib; Case/Package: 0805
C555 = CMP-00056-3: as C223 on sheet [2] Implausibilities; Thickness: 0.028inch; RoHS Compliant: Yes; ComponentLink2URL: http://katalog.we-online.de/pbs/datasheet/885012007052.pdf?src-supplier=Digi-Key; Design Item ID: C15p-50V-0805FNPC-NP0; Case Code (Metric): 2012; Max Operating Temperature: 125°C; Mount: Surface Mount; Category: Ceramic Capacitors; Min Operating Temperature: -55°C; Case/Package: 0805; ComponentLink3Description: https://katalog.we-online.de/pbs/datasheet/885012007052.pdf?src-supplier=Digi-Key; ComponentLink1Description: http://www.farnell.com/datasheets/2031702.pdf?src-supplier=Farnell; ComponentLink1URL: http://www.farnell.com/datasheets/2031702.pdf?src-supplier=Farnell; RoHS: Yes; Voltage Rating: 50V; Length: 0.079inch; Source: Passives.SchLib; Value: 15pF; Pricing 1: 1=0,10800, 10=0,05200, 25=0,05100, 50=0,04900, 100=0,04800, 250=0,04600, 500=0,04300 (USD); Tolerance: 5%; ComponentLink3URL: https://katalog.we-online.de/pbs/datasheet/885012007052.pdf?src-supplier=Digi-Key; Stock 1: 815; Packaging: Cut Tape; Width: 0.049inch; ComponentLink2Description: http://katalog.we-online.de/pbs/datasheet/885012007052.pdf?src-supplier=Digi-Key
Q501 Q502 = CMP-00142-1: Automotive N-channel 40 V (d-s) 175C Mosfet SOT-23; Manufacturer Part Number 1: SQ2318BES-T1_GE3; Manufacturer 1: Vishay; Vds: 40V; .Creator: DO; Pricing 1: 1=0,71500, 5=0,71500, 10=0,64400, 25=0,59000, 50=0,52500, 100=0,47100, 250=0,40800 (USD); RoHS: No; ComponentLink2Description: Datasheet; ComponentLink1Description: Where to buy; Design Item ID: TRT-NCH-8/40-SQ; Source: Semiconductor.SchLib; ComponentLink2URL: https://www.mouser.es/datasheet/2/427/sq2318bes-1868475.pdf; ComponentLink1URL: https://www.mouser.es/ProductDetail/Vishay-Siliconix/SQ2318BES-T1_GE3?qs=sPbYRqrBIVmyZcxPsDt0vA%3D%3D
R501-R504 R512 R513 = CMP-00076-3: Res Thick Film 0805 1K Ohm 5% 1/8W ±200ppm/°C Molded SMD SMD Paper Tape on Plastic Reel; Manufacturer Part Number 1: CR0805-JW-102ELF; Manufacturer 1: Bourns; Voltage Rating (DC): 150V; Power Rating: 125mW; .Creator: GP; Number of Terminations: 2; REACH SVHC: No SVHC; ComponentLink3URL: https://datasheet.ciiva.com/22693/1902866-22693253.pdf?src-supplier=Element14; ComponentLink1URL: https://datasheet.ciiva.com/11821/0900766b80fcdb72-11821134.pdf?src-supplier=RSComponents; ComponentLink1Description: https://datasheet.ciiva.com/11821/0900766b80fcdb72-11821134.pdf?src-supplier=RSComponents; Category: Chip SMD Resistors; Stock 1: 27510; Case/Package: 0805; ComponentLink3Description: https://datasheet.ciiva.com/22693/1902866-22693253.pdf?src-supplier=Element14; Length: 2mm; ComponentLink5URL: https://datasheet.ciiva.com/7985/1856384-7985867.pdf?src-supplier=Element14; ComponentLink7Description: https://datasheet.ciiva.com/6547/chpreztr-6547359.pdf?src-supplier=Digi-Key; Package Quantity: 1; Tolerance: 5%; Lead Free: Lead Free; RoHS: Yes; Contact Plating: Tin; ComponentLink2Description: https://datasheet.ciiva.com/15225/getdatasheetpartid-78155-15225381.pdf?src-supplier=Verical; ComponentLink5Description: https://datasheet.ciiva.com/7985/1856384-7985867.pdf?src-supplier=Element14; Depth: 1.25mm; Thickness: 508um; Resistor Type: Thick Film; Design Item ID: R1k-0805FTK; ComponentLink2URL: https://datasheet.ciiva.com/15225/getdatasheetpartid-78155-15225381.pdf?src-supplier=Verical; Max Operating Temperature: 155°C; ComponentLink6URL: https://datasheet.ciiva.com/30242/159chpreztr-30242765.pdf?src-supplier=Onlinecomponents.com; ComponentLink4URL: https://datasheet.ciiva.com/7986/1856384-7986184.pdf?src-supplier=Element14; Military Standard: Not; Case Code (Metric): 2012; Temperature Coefficient: 200ppm/°C; Pricing 1: 1=0,05930, 10=0,03510, 25=0,01790, 100=0,00800, 250=0,00790, 500=0,00590, 1000=0,00360, 3000=0,00350, 6000=0,00250 (USD); Min Operating Temperature: -55°C; ComponentLink7URL: https://datasheet.ciiva.com/6547/chpreztr-6547359.pdf?src-supplier=Digi-Key; Width: 1.25mm; Source: Passives.SchLib; Max Power Dissipation: 125mW; Voltage Rating: 150V; ComponentLink4Description: https://datasheet.ciiva.com/7986/1856384-7986184.pdf?src-supplier=Element14; Features: Moisture Resistant; Mount: Surface Mount; Termination: SMD/SMT; Height: 0.5mm; Radiation Hardening: No; ComponentLink6Description: https://datasheet.ciiva.com/30242/159chpreztr-30242765.pdf?src-supplier=Onlinecomponents.com; Pins: 2; Packaging: Tape and Reel
R505 = CMP-009-00046-1: Fixed Resistor, Metal Glaze/thick Film, 0.125W, 12400ohm, 150V, 1% +/-Tol, 100ppm/Cel, Surface Mount, 0805; Power: 125mW; Pins: 2; Max Operating Temperature: 155°C; Case/Package: 0805; Tolerance: 1%; Min Operating Temperature: -55°C; Mounting Technology: Surface Mount; RoHS Compliant: Yes
R506 R511 = CMP-009-00043-2: as R203 on sheet [2] Implausibilities; Pins: 2; RoHS Compliant: Yes; Tolerance: 1%; Case/Package: 0805; Min Operating Temperature: -55°C; Mounting Technology: Surface Mount; Max Operating Temperature: 155°C
R507 R508 R514 R515 = CMP-00083-3: Res Thick Film 0805 100 Ohm 1% 1/8W ±100ppm/°C Molded SMD SMD Paper Tape on Plastic Reel; Manufacturer 1: Bourns; Manufacturer Part Number 1: CR0805-FX-1000ELF; .Creator: DR; Voltage Rating: 150V; Power Rating: 125mW; Stock 1: 49802; Category: Chip SMD Resistors; Number of Terminations: 2; RoHS Compliant: Yes; Package Quantity: 1; Case/Package: 0805; Features: Moisture Resistant; Source: Passives.SchLib; Military Standard: Not; Construction: Rectangular; RoHS: Yes; Packaging: Tape and Reel; ComponentLink3URL: https://datasheet.ciiva.com/6547/chpreztr-6547414.pdf?src-supplier=Digi-Key; Resistance Tolerance: 1%; Termination: SMD/SMT; Height: 0.5mm; Radiation Hardening: No; Pricing 1: 1=0,05840, 10=0,03430, 25=0,01780, 100=0,00750, 250=0,00560, 500=0,00490, 3000=0,00470 (USD); ComponentLink2URL: https://datasheet.ciiva.com/6547/chpreztr-6547413.pdf?src-supplier=Digi-Key; ComponentLink5Description: https://datasheet.ciiva.com/9120/chpreztr-9120744.pdf?src-supplier=Avnet; Pins: 2; ComponentLink4URL: https://datasheet.ciiva.com/6547/chpreztr-6547415.pdf?src-supplier=Digi-Key; Temperature Coefficient: 100ppm/°C; Resistor Type: Thick Film; ComponentLink3Description: https://datasheet.ciiva.com/6547/chpreztr-6547414.pdf?src-supplier=Digi-Key; Width: 1.25mm; ComponentLink4Description: https://datasheet.ciiva.com/6547/chpreztr-6547415.pdf?src-supplier=Digi-Key; Length: 2mm; ComponentLink5URL: https://datasheet.ciiva.com/9120/chpreztr-9120744.pdf?src-supplier=Avnet; Case Code (Metric): 2012; Design Item ID: R100-0805FTK; ComponentLink1Description: https://datasheet.ciiva.com/11809/0900766b80fcdb72-11809178.pdf?src-supplier=RSComponents; ComponentLink1URL: https://datasheet.ciiva.com/11809/0900766b80fcdb72-11809178.pdf?src-supplier=RSComponents; Thickness: 508um; ComponentLink2Description: https://datasheet.ciiva.com/6547/chpreztr-6547413.pdf?src-supplier=Digi-Key; Series: CR0805; Min Operating Temperature: -55°C; REACH SVHC: No SVHC; Technology: THICK FILM; Contact Plating: Tin; Tolerance: 1%; Max Operating Temperature: 155°C; Max Power Dissipation: 125mW; Voltage Rating (DC): 150V; Depth: 1.25mm; Mount: Surface Mount
R509 R510 = CMP-009-00027-3: Fixed Resistor, Metal Glaze/thick Film, 0.5W, 2000ohm, 150V, 1% +/-Tol, 100ppm/Cel, Surface Mount, 0805; Manufacturer: Vishay; Part Number: CRCW08052K00FKEAHP; Power: 500mW; Min Operating Temperature: -55°C; Max Operating Temperature: 155°C; RoHS Compliant: Yes; Tolerance: 1%; Mounting Technology: Surface Mount; Pins: 2; Case/Package: 0805
R516-R519 = CMP-009-00008-6: Fixed Resistor, Metal Glaze/thick Film, 0.125W, 560000ohm, 150V, 1% +/-Tol, 100ppm/Cel, Surface Mount, 0805; Power: 125mW; Max Operating Temperature: 155°C; RoHS Compliant: Yes; Min Operating Temperature: -55°C; Mounting Technology: Surface Mount; Pins: 2; Case/Package: 0805; Tolerance: 1%
U401 = CMP-00215-1: NAND Gate, 4000/14000/40000 Series, 3-Func, 3-Input, CMOS, CDIP14; Min Supply Voltage: 5V; Package Body Material: Metal; Surface Mount: No; Number of Inputs: 3; Max Supply Voltage: 15V; Qualification Status: Not Qualified; Nominal Supply Voltage: 10V; Propagation Delay (tpd): 250ns; Pins: 14; Case/Package: DIP; Terminal Pitch: 2.54mm; Terminal Form: Through Hole; Height - Seated (Max): 5.08mm; Max Operating Temperature: 125°C; Min Operating Temperature: -55°C; Package Shape: Rectangular; Width: 7.62mm; Logic Type: NAND GATE; Technology: CMOS; Channels: 3; Temperature Grade: MILITARY; Terminal Position: DUAL; Package Style: IN-LINEMeter
U501 = CMP-00217-1: as U201 on sheet [2] Implausibilities; Length: 8.65mm; Technology: CMOS; Surface Mount: Yes; Packaging: Rail/Tube; JESD-609 Code: e4; Terminal Pitch: 1.27mm; Package Shape: Rectangular; Package Style: SMALL OUTLINEMeter; Max Operating Temperature: 125°C; Terminal Position: DUAL; Reach SVHC Compliant: Yes; Terminal Form: Gull Wing; JESD-30 Code: R-PDSO-G14; Width: 3.9mm; Moisture Sensitivity Level: 1; Peak Reflow Temperature (Cel): 260°C; Temperature Grade: MILITARY; Pins: 14; Case/Package: SOP; Terminal Finish: Nickel; Min Operating Temperature: -55°C; Height - Seated (Max): 1.75mm; Prop. Delay@Nom-Sup: 250ns; RoHS Compliant: Yes
U502 U503 = CMP-014-00006-1: Comparator, 4 Func, 5000uV Offset-Max, 300ns Response Time, BIPolar, PDSO14; Nominal Supply Voltage: 5V; Channels: 4; Output Type: OPEN-COLLECTOR; Case/Package: SOP; Pins: 14; Max Operating Temperature: 70°C; Min Operating Temperature: 0°C; RoHS Compliant: Yes
Z501 Z502 = CMP-004-00007-3: Zener Diode, 5.6V V(Z), 5%, 0.5W, Silicon, Unidirectional, DO-214AC; Pins: 2; RoHS Compliant: Yes; Min Operating Temperature: -65°C; Max Operating Temperature: 150°C
Z503 = CMP-004-00020-2: Zener Diode, 3.6V V(Z), 5.56%, 1.25W, Silicon, Unidirectional, DO-214AC, BZG05C3V6-M3-08; Max Operating Temperature: 150°C; RoHS Compliant: Yes; Pins: 2